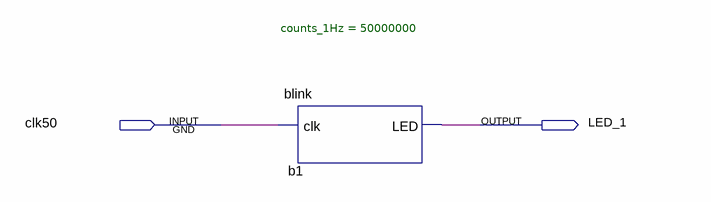
[diagram p0: schematic sheet]
// Quartus schematic blinkdev.bdf as structural Verilog: 1 symbols, 2 pins
module blinkdev (
  input  clk50,
  output LED_1
);

  blink #(.counts_1Hz(50000000)) b1 (.clk(clk50), .LED(LED_1));
endmodule
